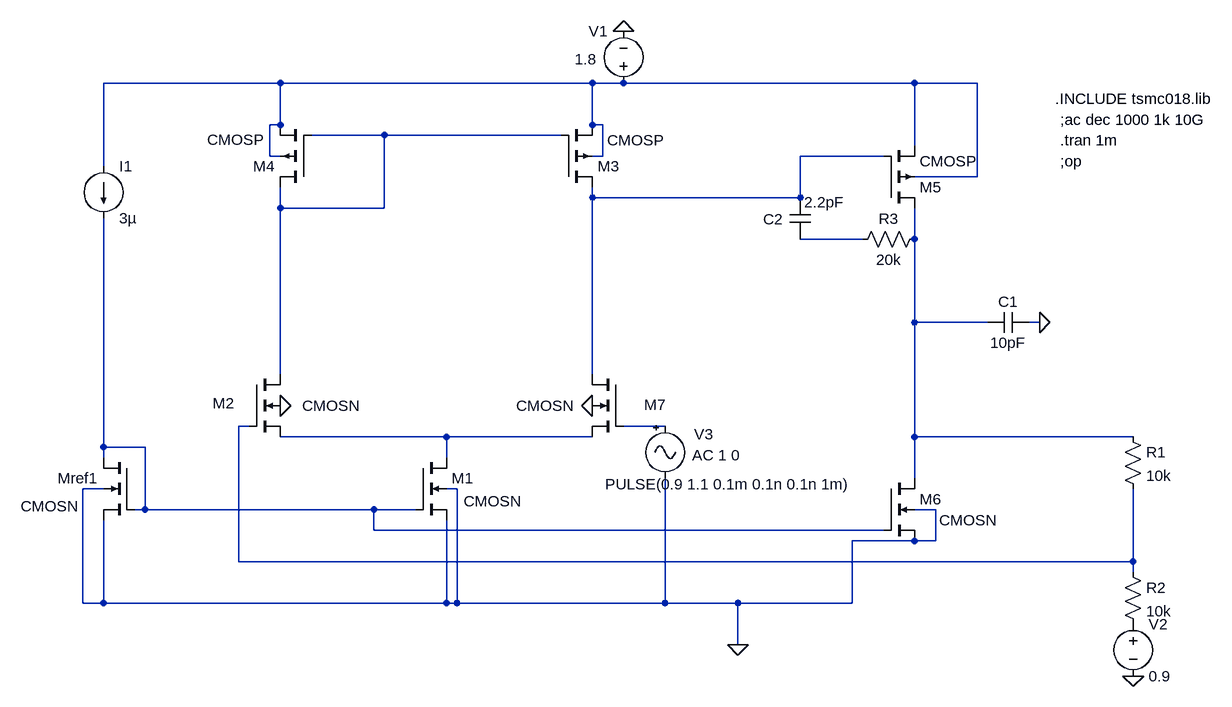
[diagram p0: schematic closed_loop.asc]
closed_loop.asc, the LTspice schematic file:
Version 4
SHEET 1 2084 1284
WIRE 592 352 320 352
WIRE 1024 352 592 352
WIRE 1072 352 1024 352
WIRE 1120 352 1072 352
WIRE 1568 352 1120 352
WIRE 1664 352 1568 352
WIRE 592 416 592 352
WIRE 592 416 576 416
WIRE 1072 416 1072 352
WIRE 1088 416 1072 416
WIRE 752 432 640 432
WIRE 880 432 752 432
WIRE 1024 432 880 432
WIRE 1568 448 1568 352
WIRE 576 464 576 416
WIRE 592 464 576 464
WIRE 1088 464 1088 416
WIRE 1088 464 1072 464
WIRE 1520 464 1392 464
WIRE 320 480 320 352
WIRE 1664 496 1664 352
WIRE 1664 496 1568 496
WIRE 1072 528 1072 512
WIRE 1232 528 1072 528
WIRE 1392 528 1392 464
WIRE 1392 528 1232 528
WIRE 592 544 592 512
WIRE 672 544 592 544
WIRE 752 544 752 432
WIRE 752 544 672 544
WIRE 1072 576 1072 528
WIRE 1488 592 1392 592
WIRE 1568 592 1568 544
WIRE 1568 720 1568 592
WIRE 1680 720 1568 720
WIRE 1760 720 1744 720
WIRE 592 800 592 544
WIRE 1072 800 1072 576
WIRE 544 880 528 880
WIRE 1184 880 1120 880
WIRE 848 896 592 896
WIRE 864 896 848 896
WIRE 1072 896 864 896
WIRE 1568 896 1568 720
WIRE 1904 896 1568 896
WIRE 320 912 320 560
WIRE 384 912 320 912
WIRE 320 928 320 912
WIRE 848 928 848 896
WIRE 1568 960 1568 896
WIRE 320 976 288 976
WIRE 864 976 848 976
WIRE 384 1008 384 912
WIRE 384 1008 368 1008
WIRE 736 1008 384 1008
WIRE 800 1008 736 1008
WIRE 1600 1008 1568 1008
WIRE 736 1040 736 1008
WIRE 1072 1040 736 1040
WIRE 1520 1040 1072 1040
WIRE 1568 1056 1472 1056
WIRE 1600 1056 1600 1008
WIRE 1600 1056 1568 1056
WIRE 528 1088 528 880
WIRE 1856 1088 528 1088
WIRE 1904 1088 1904 976
WIRE 1904 1088 1856 1088
WIRE 1904 1104 1904 1088
WIRE 288 1152 288 976
WIRE 320 1152 320 1024
WIRE 320 1152 288 1152
WIRE 848 1152 848 1024
WIRE 848 1152 320 1152
WIRE 864 1152 864 976
WIRE 864 1152 848 1152
WIRE 1184 1152 1184 960
WIRE 1184 1152 864 1152
WIRE 1296 1152 1184 1152
WIRE 1472 1152 1472 1056
WIRE 1472 1152 1296 1152
WIRE 1296 1216 1296 1152
FLAG 1120 272 0
FLAG 592 848 0
FLAG 1904 1264 0
FLAG 1760 720 0
FLAG 1072 848 0
FLAG 1296 1216 0
DATAFLAG 1024 352 ""
DATAFLAG 672 544 ""
DATAFLAG 864 896 ""
DATAFLAG 1232 528 ""
DATAFLAG 1072 1040 ""
DATAFLAG 1856 1088 ""
DATAFLAG 880 432 ""
DATAFLAG 1072 576 ""
SYMBOL cmosn 368 928 M0
WINDOW 3 86 75 Left 2
SYMATTR InstName Mref1
SYMATTR Value2 l=1u w=2u
SYMBOL current 320 480 R0
WINDOW 123 0 0 Left 2
WINDOW 39 0 0 Left 2
SYMATTR InstName I1
SYMATTR Value 3µ
SYMBOL cmosn 800 928 R0
WINDOW 3 74 67 Left 2
SYMATTR InstName M1
SYMATTR Value2 l=1u w=21u
SYMBOL cmosn 544 800 R0
WINDOW 3 82 48 Left 2
WINDOW 0 -56 44 Left 2
SYMATTR InstName M2
SYMATTR Value2 l=1u w=13.04u
SYMBOL cmosp 1024 512 M180
WINDOW 3 71 72 Left 2
SYMATTR InstName M3
SYMATTR Value2 l=1u w=4u
SYMBOL cmosp 640 512 R180
WINDOW 3 73 73 Left 2
SYMATTR InstName M4
SYMATTR Value2 l=1u w=4u
SYMBOL voltage 1120 368 R180
WINDOW 0 24 96 Left 2
WINDOW 3 41 53 Left 2
WINDOW 123 0 0 Left 2
WINDOW 39 0 0 Left 2
SYMATTR InstName V1
SYMATTR Value 1.8
SYMBOL cmosp 1520 544 M180
SYMATTR InstName M5
SYMATTR Value2 l=1u w=8u
SYMBOL cmosn 1520 960 R0
WINDOW 3 86 64 Left 2
SYMATTR InstName M6
SYMATTR Value2 l=1u w=20u
SYMBOL res 1888 880 R0
SYMATTR InstName R1
SYMATTR Value 10k
SYMBOL res 1888 1088 R0
SYMATTR InstName R2
SYMATTR Value 10k
SYMBOL voltage 1904 1168 R0
WINDOW 123 0 0 Left 2
WINDOW 39 0 0 Left 2
SYMATTR InstName V2
SYMATTR Value 0.9
SYMBOL Misc\\signal 1184 864 R0
WINDOW 123 42 60 Left 2
WINDOW 39 0 0 Left 2
WINDOW 0 45 28 Left 2
WINDOW 3 -92 105 Left 2
SYMATTR Value2 AC 1 0
SYMATTR InstName V3
SYMATTR Value PULSE(0.9 1.1 0.1m 0.1n 0.1n 1m)
SYMBOL cap 1744 704 R90
WINDOW 0 0 32 VBottom 2
WINDOW 3 32 32 VTop 2
SYMATTR InstName C1
SYMATTR Value 10pF
SYMBOL cap 1376 528 R0
WINDOW 0 -41 33 Left 2
WINDOW 3 22 7 Left 2
SYMATTR InstName C2
SYMATTR Value 2.2pF
SYMBOL res 1584 576 R90
WINDOW 0 0 56 VBottom 2
WINDOW 3 32 56 VTop 2
SYMATTR InstName R3
SYMATTR Value 20k
SYMBOL cmosn 1120 800 M0
WINDOW 3 76 48 Left 2
WINDOW 0 -66 47 Left 2
SYMATTR InstName M7
SYMATTR Value2 l=1u w=13.04u
TEXT 1784 376 Left 2 !.INCLUDE tsmc018.lib
TEXT 1792 440 Left 2 !.tran 1m
TEXT 1792 408 Left 2 !;ac dec 1000 1k 10G
TEXT 1792 472 Left 2 !;op

The netlist it stands for:
* closed_loop.asc
Mref1 N009 N009 0 0 CMOSN l=1u w=2u
I1 N001 N009 3µ
M1 N008 N009 0 0 CMOSN l=1u w=21u
M2 N002 N006 N008 0 CMOSN l=1u w=13.04u
M3 N003 N002 N001 N001 CMOSP l=1u w=4u
M4 N002 N002 N001 N001 CMOSP l=1u w=4u
V1 N001 0 1.8
M5 N005 N003 N001 N001 CMOSP l=1u w=8u
M6 N005 N009 0 0 CMOSN l=1u w=20u
R1 N005 N006 10k
R2 N006 P001 10k
V2 P001 0 0.9
V3 N007 0 PULSE(0.9 1.1 0.1m 0.1n 0.1n 1m) AC 1 0
C1 0 N005 10pF
C2 N003 N004 2.2pF
R3 N005 N004 20k
M7 N003 N007 N008 0 CMOSN l=1u w=13.04u
.model NMOS NMOS
.model PMOS PMOS
.lib standard.mos
.INCLUDE tsmc018.lib
.tran 1m
;ac dec 1000 1k 10G
;op
.backanno
.end